# Altium schematic sheet SensWear_Haptic.SchDoc
size A4; Size: A4; SheetNumber: 1; SheetTotal: 1
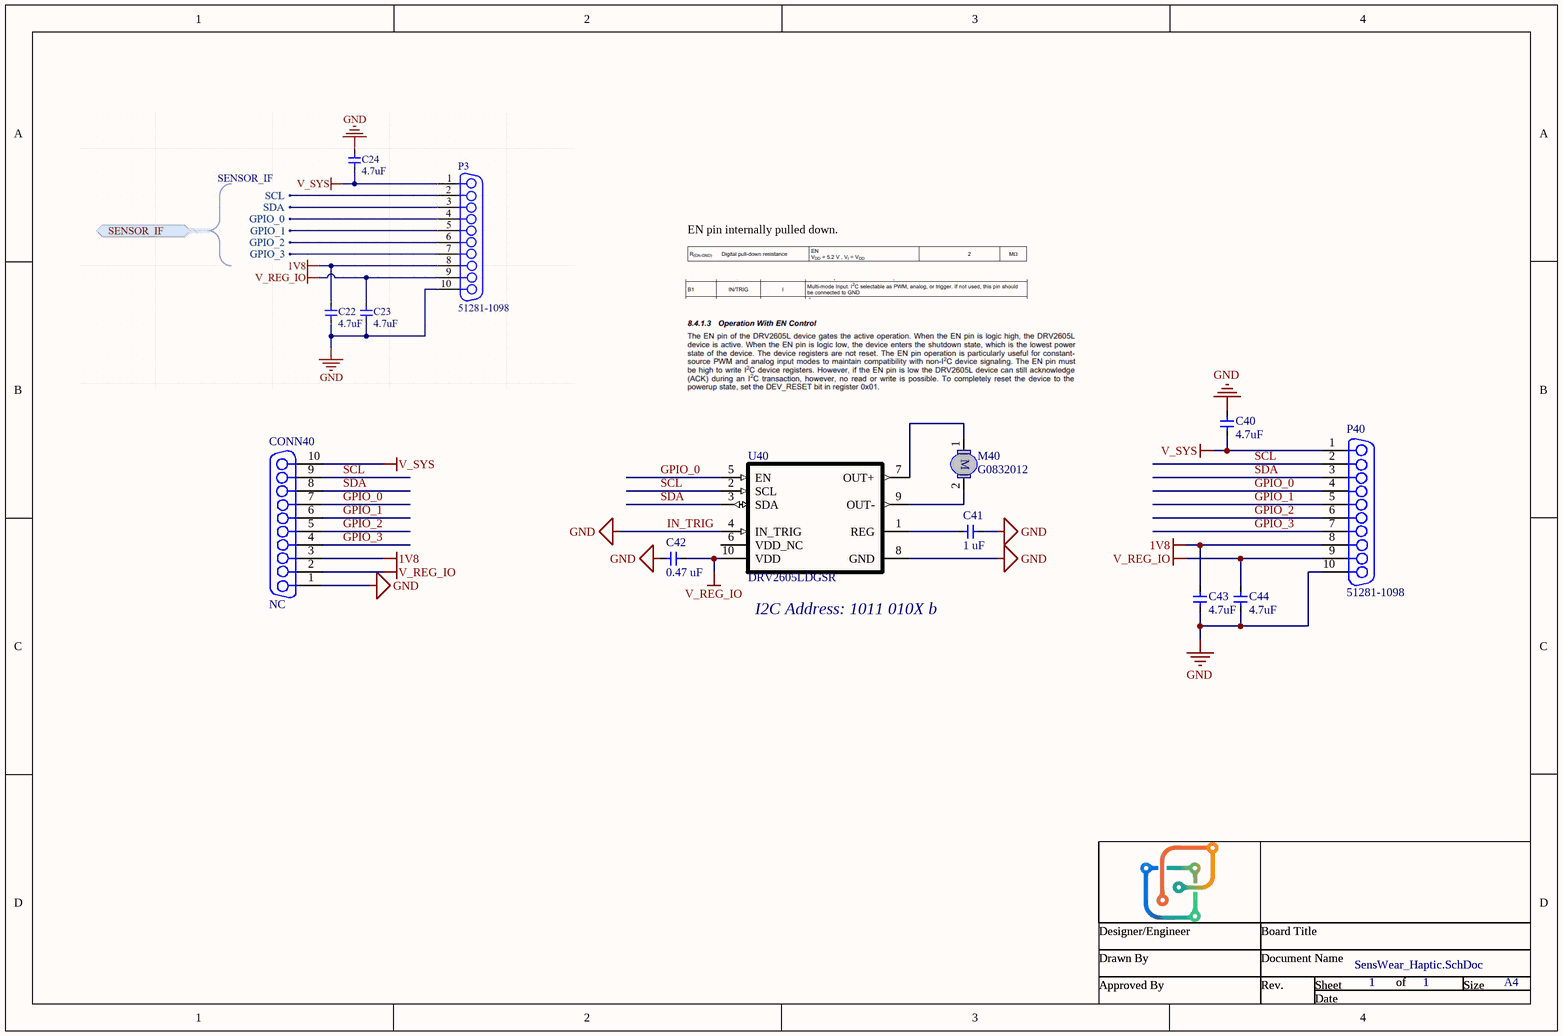
[diagram p0: SensWear_Haptic.SchDoc]

## Parts
C40  4.7uF  [CAPC1005X05N]
C41  1 uF  [CAPC1005X05N]
C42  0.47 uF  [CAPC1005X05N]
C43  4.7uF  [CAPC1005X05N]
C44  4.7uF  [CAPC1005X05N]
CONN40  NC  [51281-1098-PCB]
M40  G0832012  [G0832012]
P40  51281-1098  [51281-1098__3]
U40  DRV2605LDGSR  [TSSOP50P490X110-10N]

## Nets
1V8: C43.2 CONN40.3 P40.8
IN_TRIG: C40.2 C41.1 C42.2 C43.1 C44.1 CONN40.1 P40.10 U40.4(IN_TRIG) U40.8(GND)  [also labelled GND]
V_REG_IO: C42.1 C44.2 CONN40.2 P40.9 U40.10(VDD)
V_SYS: C40.1 CONN40.10 P40.1
GPIO_0: CONN40.7 P40.4 U40.5(EN)
GPIO_1: CONN40.6 P40.5
GPIO_2: CONN40.5 P40.6
GPIO_3: CONN40.4 P40.7
SCL: CONN40.9 P40.2 U40.2(SCL)
SDA: CONN40.8 P40.3 U40.3(SDA)
NetC41_2: C41.2 U40.1(REG)
NetM40_1: M40.1(V+) U40.7(OUT+)
NetM40_2: M40.2(V+) U40.9(OUT-)

Not connected (* = marked no-connect by the designer): U40 6(VDD_NC)

## Notes on the sheet
- EN pin internally pulled down.
- (near U40) I2C Address: 1011 010X b
- Designer/Engineer
- Drawn By
- Document Name
- Board Title
- Sheet
- of
- Size
- A4
- Approved By
- Rev.
- Date
- (in symbol G0832012) M

## Library data of the parts
C40 C43 C44 = GRM155R61A475MEAAD: Multilayer Ceramic Capacitor, 4.7 uF, 10 V, ± 20%, X5R, 0402 [1005 Metric]; Manufacturer: Murata; Material: 4241ConductorMaterial; Voltage Rating: 10V; Dielectric: 1537DielectricType; Manufacturer Part Number: GRM155R61A475MEAAD; RoHS: Yes; Category: Ceramic Capacitors; Stock: 930000; Pricing: 10000=0,0187, 50000=0,0159, 100000=0,0132 (USD); Mounting Technology: Surface Mount; Case/Package: 0402; Case Code (Imperial): 0402; Case Code (Metric): 1005; Min Operating Temperature: -55°C; Max Operating Temperature: 85°C; Packaging: Tape and Reel; Value: 4.7uF; Tolerance: 20%; Series: GRM; Voltage Rating (DC): 10V; Length: 1mm; Width: 500um; Height: 650um; Thickness: 500um; RoHS Compliant: Yes; ComponentLink1URL: http://www.farnell.com/datasheets/2189109.pdf?src-supplier=Farnell; ComponentLink1Description: http://www.farnell.com/datasheets/2189109.pdf?src-supplier=Farnell; ComponentLink2URL: http://www.farnell.com/datasheets/2189109.pdf?src-supplier=Newark; ComponentLink2Description: http://www.farnell.com/datasheets/2189109.pdf?src-supplier=Newark; ComponentLink3URL: http://www.farnell.com/datasheets/2189109.pdf?src-supplier=Element14; ComponentLink3Description: http://www.farnell.com/datasheets/2189109.pdf?src-supplier=Element14; ComponentLink4URL: http://datasheet.octopart.com/GRM155R61A475MEAAD-Murata-datasheet-68589269.pdf?src-supplier=Distrelec; ComponentLink4Description: http://datasheet.octopart.com/GRM155R61A475MEAAD-Murata-datasheet-68589269.pdf?src-supplier=Distrelec; ComponentLink5URL: http://datasheet.octopart.com/GRM155R61A475MEAAD-Murata-datasheet-68589269.pdf?src-supplier=Farnell; ComponentLink5Description: http://datasheet.octopart.com/GRM155R61A475MEAAD-Murata-datasheet-68589269.pdf?src-supplier=Farnell; ComponentLink6URL: https://search.murata.co.jp/Ceramy/image/img/A01X/G101/ENG/GRM155R61A475MEAA-01.pdf?src-supplier=Digi-Key; ComponentLink6Description: https://search.murata.co.jp/Ceramy/image/img/A01X/G101/ENG/GRM155R61A475MEAA-01.pdf?src-supplier=Digi-Key; ComponentLink7URL: http://datasheet.octopart.com/GRM155R61A475MEAAD-Murata-datasheet-68589269.pdf?src-supplier=Future+Electronics; ComponentLink7Description: http://datasheet.octopart.com/GRM155R61A475MEAAD-Murata-datasheet-68589269.pdf?src-supplier=Future+Electronics; ComponentLink8URL: https://datasheet.octopart.com/GRM155R61A475MEAAD-Murata-datasheet-68589269.pdf?src-supplier=Newark; ComponentLink8Description: https://datasheet.octopart.com/GRM155R61A475MEAAD-Murata-datasheet-68589269.pdf?src-supplier=Newark; ComponentLink9URL: http://datasheet.octopart.com/GRM155R61A475MEAAD-Murata-datasheet-68589269.pdf?src-supplier=Verical; ComponentLink9Description: http://datasheet.octopart.com/GRM155R61A475MEAAD-Murata-datasheet-68589269.pdf?src-supplier=Verical; ComponentLink10URL: https://datasheet.octopart.com/GRM155R61A475MEAAD-Murata-datasheet-165579666.pdf?src-supplier=TME; ComponentLink10Description: https://datasheet.octopart.com/GRM155R61A475MEAAD-Murata-datasheet-165579666.pdf?src-supplier=TME; ComponentLink11URL: http://datasheet.octopart.com/GRM155R61A475MEAAD-Murata-datasheet-68589269.pdf?src-supplier=Quest; ComponentLink11Description: http://datasheet.octopart.com/GRM155R61A475MEAAD-Murata-datasheet-68589269.pdf?src-supplier=Quest; ComponentLink12URL: http://datasheet.octopart.com/GRM155R61A475MEAAD-Murata-datasheet-68589269.pdf?src-supplier=TTI; ComponentLink12Description: http://datasheet.octopart.com/GRM155R61A475MEAAD-Murata-datasheet-68589269.pdf?src-supplier=TTI; ComponentLink13URL: http://datasheet.octopart.com/GRM155R61A475MEAAD-Murata-datasheet-68589269.pdf?src-supplier=NAC+Semi; ComponentLink13Description: http://datasheet.octopart.com/GRM155R61A475MEAAD-Murata-datasheet-68589269.pdf?src-supplier=NAC+Semi; Supplier 1: Mouser; Supplier Part Number 1: 81-GRM155R61A475MEAD; Supplier 2: Farnell; Supplier Part Number 2: 3581674
C41 = GRM155R61A105KE15D: CAP CER 1UF 10V X5R 0402; Manufacturer: Murata Electronics North America; Capacitance: 1µF; Tolerance: ±10%; Supplier 1: Digi-Key; Manufacturer Part Number: GRM155R61A105KE15D; RoHS: RoHS Compliant; Category: Capacitors; Stock 1: 5520111; Pricing 1: 1=0.1, 10=0.024, 50=0.013, 100=0.011, 250=0.009, 500=0.0077, 1000=0.006, 5000=0.005 (USD); Packaging: Digi-Reel®; Part Status: Active; Voltage - Rated: 10V; Temperature Coefficient: X5R; Mounting Type: Surface Mount, MLCC; Operating Temperature: -55°C ~ 85°C; Applications: General Purpose; Ratings: -; Package / Case: 0402 (1005 Metric); Size / Dimension: 0.039" L x 0.020" W (1.00mm x 0.50mm); Height - Seated (Max): -; Thickness (Max): 0.022" (0.55mm); Lead Spacing: -; Features: -; Lead Style: -; ComponentLink1URL: http://www.murata.com/~/media/webrenewal/support/library/catalog/products/capacitor/mlcc/c02e.ashx; ComponentLink1Description: http://www.murata.com/~/media/webrenewal/support/library/catalog/products/capacitor/mlcc/c02e.ashx; Supplier Part Number 1: 490-3890-6-ND; Value: 1 uF
C42 = GRM155R61A474KE15D: CAP CER 0.47UF 10V X5R 0402; Manufacturer: Murata Electronics North America; Capacitance: 0.47µF; Tolerance: ±10%; Supplier 1: Digi-Key; Manufacturer Part Number: GRM155R61A474KE15D; RoHS: RoHS Compliant; Category: Capacitors; Stock 1: 715573; Pricing 1: 1=0.08, 10=0.054, 50=0.029, 100=0.0246, 250=0.02008, 500=0.01718, 1000=0.01339, 5000=0.01116 (GBP); Packaging: Digi-Reel®; Part Status: Active; Voltage - Rated: 10V; Temperature Coefficient: X5R; Mounting Type: Surface Mount, MLCC; Operating Temperature: -55°C ~ 85°C; Applications: General Purpose; Ratings: -; Package / Case: 0402 (1005 Metric); Size / Dimension: 0.039" L x 0.020" W (1.00mm x 0.50mm); Height - Seated (Max): -; Thickness (Max): 0.022" (0.55mm); Lead Spacing: -; Features: -; Lead Style: -; ComponentLink1URL: http://www.murata.com/~/media/webrenewal/support/library/catalog/products/capacitor/mlcc/c02e.pdf; ComponentLink1Description: http://www.murata.com/~/media/webrenewal/support/library/catalog/products/capacitor/mlcc/c02e.pdf; Supplier Part Number 1: 490-3264-6-ND; Value: 0.47 uF
CONN40 = 51281-1098-PCB: System: Connector
M40 = G0832012: VIBRATION MOTOR 1.8V; Manufacturer: Jinlong Machinery & Electronics, Inc.; Function: Vibration, LRA; Voltage - Rated: 1.8VAC; Supplier 1: Digi-Key; Manufacturer Part Number: G0832012; RoHS: RoHS Compliant; Category: Motors, Solenoids, Driver Boards/Modules; Stock: 810; Pricing: 1=3.17, 5=3.002, 10=2.918, 25=2.8348, 50=2.5846, 100=2.3345, 250=2.25112, 500=2.21778, 1000=2.08438 (USD); Part Status: Active; Type: AC Motor; Motor Type: -; RPM: -; Torque - Rated (oz-in / mNm): -; Power - Rated: -; Encoder Type: -; Size / Dimension: Round - 0.315" Dia (8.00mm); Diameter - Shaft: -; Length - Shaft and Bearing: -; Mounting Hole Spacing: -; Termination Style: Wire Leads; Features: -; Gear Reduction Ratio: -; Torque - Max Momentary (oz-in / mNm): -; Operating Temperature: -20°C ~ 60°C; Approvals: -; Weight: -; ComponentLink1URL: http://www.vibration-motor.com/products/download/G0832012.pdf; ComponentLink1Description: http://www.vibration-motor.com/products/download/G0832012.pdf; Supplier Part Number 1: 1670-1034-ND
P40 = 51281-1098: FFC/FPC Connector, Surface Mount, Right-Angle, Non-ZIF, Dual Contact Style; Manufacturer: Molex; Supplier: Digikey; Supplier Part Number: 900-0512811098CT-ND; Manufacturer Part Number: 51281-1098; RoHS: No; Stock: 2876; Pricing: 1=0.7, 10=0.594, 25=0.5568, 50=0.53, 100=0.5047, 250=0.47304, 500=0.45042, 1000=0.42891 (USD); ComponentLink1URL: https://datasheet.octopart.com/51281-1098-Molex-datasheet-165827616.pdf?src-supplier=Farnell; ComponentLink1Description: https://datasheet.octopart.com/51281-1098-Molex-datasheet-165827616.pdf?src-supplier=Farnell; Supplier 1: Mouser; Supplier Part Number 1: 538-51281-1098; Supplier 2: Digikey; Supplier Part Number 2: 900-0512811098CT-ND; Supplier 3: Digikey; Supplier Part Number 3: 900-0512811098DKR-ND; System: Connector
U40 = DRV2605LDGSR: NEXT GEN DRV260X LRA/ERM DRIVER; Manufacturer: Texas Instruments; Motor Type - AC, DC: ERM, LRA; Function: Driver - Fully Integrated, Control and Power Stage; Output Configuration: Half Bridge (2); Interface: I²C; Voltage - Supply: 2 V ~ 5.5 V; Manufacturer Part Number: DRV2605LDGSR; RoHS: RoHS Compliant; Category: Integrated Circuits (ICs); ComponentLink1URL: http://www.ti.com/lit/ds/symlink/drv2605l.pdf; ComponentLink1Description: http://www.ti.com/lit/ds/symlink/drv2605l.pdf; Supplier 1: Digi-Key; Supplier Part Number 1: 296-40032-6-ND; Stock 1: 2856; Pricing 1: 1=4.18, 10=3.751, 100=3.073, 500=2.616, 1000=2.20626 (USD); Packaging: Digi-Reel®; Part Status: Active; Motor Type - Stepper: -; Technology: Power MOSFET; Step Resolution: -; Applications: Haptic Feedback; Current - Output: -; Voltage - Load: 2 V ~ 5.5 V; Operating Temperature: -40°C ~ 150°C (TJ); Mounting Type: Surface Mount; Package / Case: 10-TFSOP, 10-MSOP (0.118", 3.00mm Width); Supplier Device Package: 10-VSSOP